# Altium schematic sheet CB_CONNECTOR.SchDoc
size A4; SheetNumber: 17; SheetTotal: 18
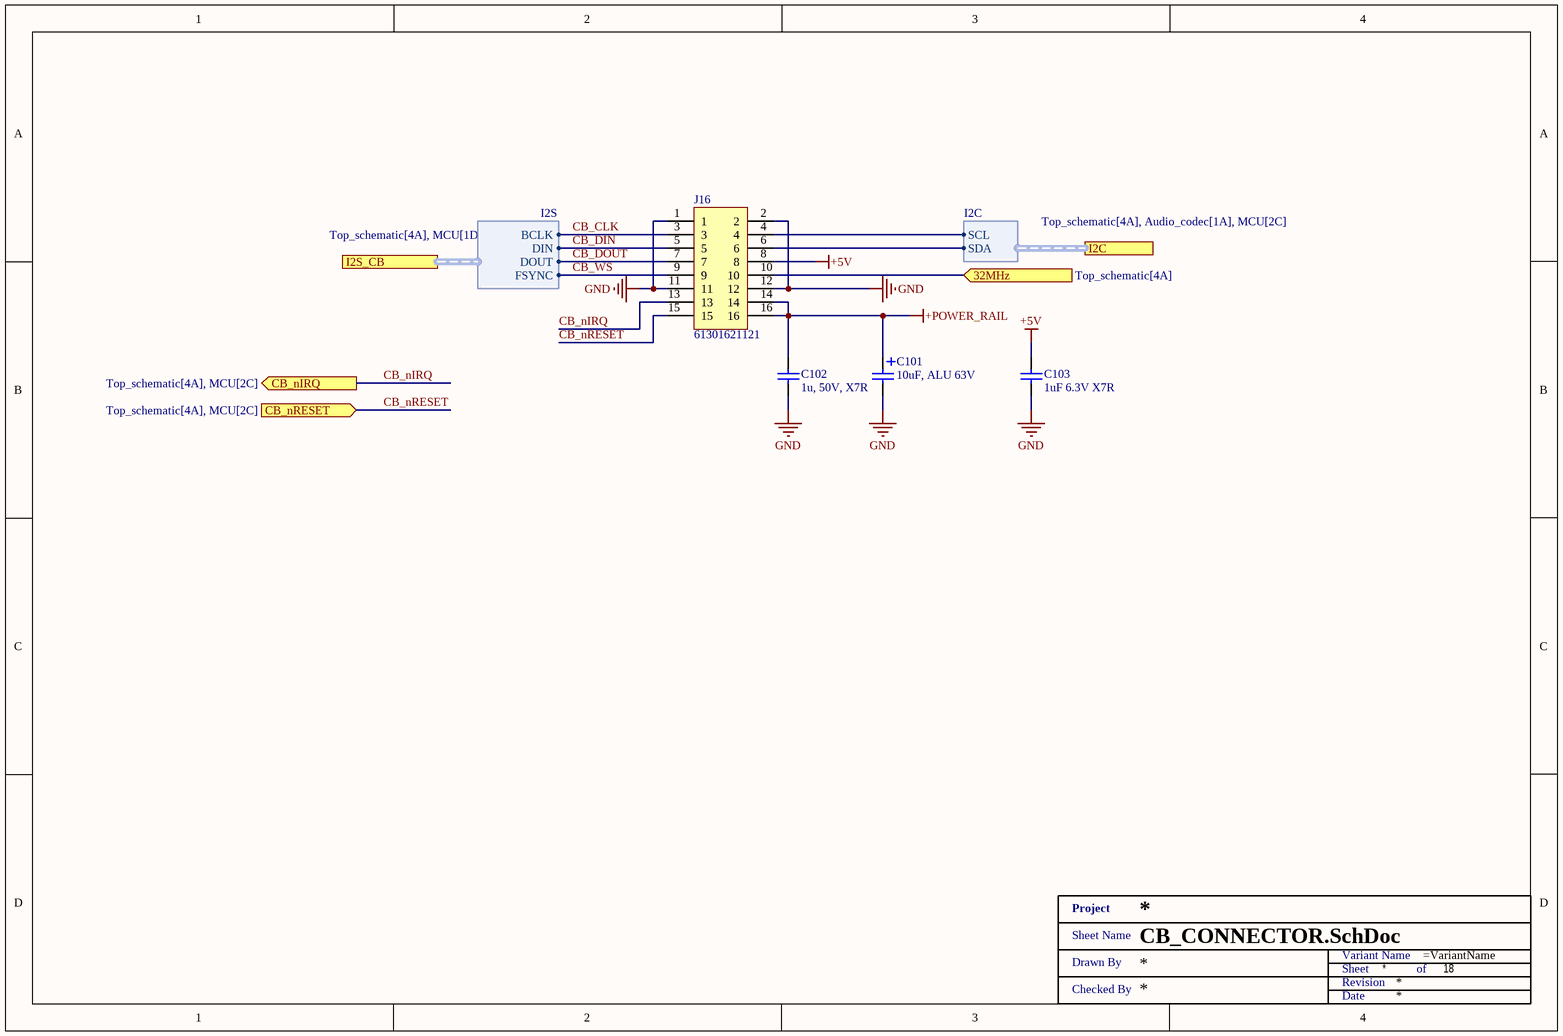
[diagram p0: CB_CONNECTOR.SchDoc]

## Parts
C101  10uF, ALU 63V  [WCAP-ATLI_5x11x2]
C102  1u, 50V, X7R  [SMD0603]
C103  1uF 6.3V X7R  [SMD0402]
J16  61301621121  [61301621121]
XX?  Title 1  (value not drawn)  (graphical)

## Ports
32MHz (in, see Top_schematic[4A]), CB_nIRQ (out, see Top_schematic[4A], MCU[2C]), CB_nRESET (in, see Top_schematic[4A], MCU[2C]), I2C (harness I2C, see Top_schematic[4A], Audio_codec[1A], MCU[2C]), I2S_CB (harness I2S, see Top_schematic[4A], MCU[1D])

## Harnesses
I2S: BCLK, DIN, DOUT, FSYNC
I2C: SCL, SDA

## Nets
+5V: C103.2 J16.8
+POWER_RAIL: C101.1 C102.2 J16.14 J16.16
GND: C101.2 C102.1 C103.1 J16.1 J16.2 J16.11 J16.12
32MHz: J16.10 ; port 32MHz
CB_CLK: J16.3 ; port I2S_CB.BCLK
CB_DIN: J16.5 ; port I2S_CB.DIN
CB_DOUT: J16.7 ; port I2S_CB.DOUT
CB_nIRQ: J16.13 ; port CB_nIRQ
CB_nRESET: J16.15 ; port CB_nRESET
CB_WS: J16.9 ; port I2S_CB.FSYNC
NetJ16_4: J16.4 ; port I2C.SCL
NetJ16_6: J16.6 ; port I2C.SDA

## Notes on the sheet
- (in symbol Title 1) Project; Sheet Name; Variant Name; Drawn By; Sheet; of; Revision; Checked By; Date

## Library data of the parts
C101 = 860080772001: WURTH ELEKTRONIK - 860080772001 - CAP, ALU ELEC, 10UF, 63V, RADIAL; Ripple Current: 135mA @ 100kHz; Capacitance: 10u; Manufacturer: WURTH ELEKTRONIK; Manufacturer Part Number: 860080772001; RoHS: YES; Stock 1: 553; Pricing 1: 1=0.0957, 3=0.091, 5=0.0863, 10=0.0825, 20=0.0786, 50=0.0692, 250=0.0647, 500=0.0564 (GBP); ComponentLink1URL: http://www.farnell.com/datasheets/1879798.pdf; ComponentLink1Description: http://www.farnell.com/datasheets/1879798.pdf; Voltage Rating: 63V; Stock 3: 2136; Pricing 3: 1=0.62, 50=0.335, 100=0.289, 250=0.259, 500=0.235, 1500=0.202, 7500=0.182, 15000=0.178 (GBP); ComponentLink2URL: http://www.farnell.com/datasheets/2065186.pdf; ComponentLink2Description: http://www.farnell.com/datasheets/2065186.pdf; Supplier 1: Mouser; Supplier Part Number 1: 710-860080772001; Supplier 2: Farnell; Supplier Part Number 2: 2465955; Supplier 3: Digi-Key; Supplier Part Number 3: 732-9121-1-ND
C102 = UMK107AB7105KA-T: 0603 1 uF 50 V ±10% Tolerance X7R SMT Multilayer Ceramic Capacitor; Manufacturer: Taiyo Yuden; Supplier 1: Mouser; Supplier Part Number 1: 963-UMK107AB7105KA-T; Manufacturer Part Number: UMK107AB7105KA-T; RoHS: Yes; Category: Ceramic Capacitors; Stock 1: 419967; Pricing 1: 1=0,39000, 10=0,13500, 100=0,09200, 500=0,07800, 1000=0,06100, 4000=0,06100 (USD); Mount: Surface Mount; Case/Package: 0603; Case Code (Metric): 1608; Case Code (Imperial): 0603; Min Operating Temperature: -55°C; Max Operating Temperature: 125°C; Tolerance: 10%; Capacitance: 1u; Packaging: Tape and Reel; Package Quantity: 1; Voltage Rating: 50V; Voltage Rating (DC): 50V; Dielectric: X7R; Termination: SMD/SMT; Length: 1.6mm; Height: 0.8mm; Width: 0.031inch; Thickness: 0.037inch; Depth: 0.8mm; Radiation Hardening: No; Halogen Free: Halogen Free; ComponentLink1URL: https://datasheet.ciiva.com/15922/umk107ab7105ka-t-pdf-15922601.pdf?src-supplier=Onlinecomponents.com; ComponentLink1Description: https://datasheet.ciiva.com/15922/umk107ab7105ka-t-pdf-15922601.pdf?src-supplier=Onlinecomponents.com; ComponentLink2URL: https://datasheet.ciiva.com/6257/umk107ab7105ka-t-ss-6257600.pdf?src-supplier=Digi-Key; ComponentLink2Description: https://datasheet.ciiva.com/6257/umk107ab7105ka-t-ss-6257600.pdf?src-supplier=Digi-Key; ComponentLink3URL: https://datasheet.ciiva.com/30137/76umk107ab7105ka-t-30137806.pdf?src-supplier=Onlinecomponents.com; ComponentLink3Description: https://datasheet.ciiva.com/30137/76umk107ab7105ka-t-30137806.pdf?src-supplier=Onlinecomponents.com; Supplier 2: Farnell; Supplier Part Number 2: 2779113; Supplier 3: Digi-Key; Supplier Part Number 3: 587-3247-6-ND
C103 = TCC0402X7R105K6R3AT: Capacitor: MLCC; SMD; 0402; 1µF; 6.3V; ±10%; X7R; CCTC; Capacitance: 1u; Supplier 1: LCSC; Supplier Part Number 1: C5448871; Manufacturer: CCTC; Manufacturer Part Number: TCC0402X7R105K6R3AT; Category: Ceramic Capacitors; Stock 1: 242350; Pricing 1: 50=0.0089, 500=0.0072, 1500=0.0063, 10000=0.0058, 20000=0.0053, 50000=0.005 (USD); ComponentLink1URL: https://datasheet.octopart.com:443/TCC0402X7R105K6R3AT-CCTC-datasheet-194166649.pdf?src-supplier=LCSC; ComponentLink1Description: https://datasheet.octopart.com:443/TCC0402X7R105K6R3AT-CCTC-datasheet-194166649.pdf?src-supplier=LCSC; ComponentLink2URL: https://datasheet.octopart.com:443/TCC0402X7R105K6R3AT-CCTC-datasheet-192317456.pdf?src-supplier=HQonline; ComponentLink2Description: https://datasheet.octopart.com:443/TCC0402X7R105K6R3AT-CCTC-datasheet-192317456.pdf?src-supplier=HQonline
J16 = 61301621121: WR-PHD 2.54 mm THT Dual Pin Header, 16 pins; Manufacturer: Wurth Electronics; Number of Positions: 16; Gender: Male; Connector Type: Male Pin; Pitch: 0.1inch; Supplier 1: Mouser; Supplier Part Number 1: 710-61301621121; Manufacturer Part Number: 61301621121; RoHS: Yes; Category: Headers and Wire Housings; Stock 1: 8961; Pricing 1: 1=1,02000, 10=0,89100, 50=0,61900, 100=0,56200, 1000=0,51200, 10000=0,51100 (USD); Mount: Through Hole; Contact Plating: Gold; Contact Material: Copper; Color: Black; Number of Rows: 2; Packaging: Bulk; Termination: Solder; Number of Contacts: 16; Series: WR-PHD; Contact Type: Male Pin; Row Spacing: 0.1inch; Contact Mating Length: 0.236inch; RoHS Compliant: Yes; ComponentLink1URL: https://datasheet.ciiva.com/28505/1442180-28505592.pdf?src-supplier=Element14; ComponentLink1Description: https://datasheet.ciiva.com/28505/1442180-28505592.pdf?src-supplier=Element14; Supplier 2: Farnell; Supplier Part Number 2: 2356136; Supplier 3: Digi-Key; Supplier Part Number 3: 732-5299-ND